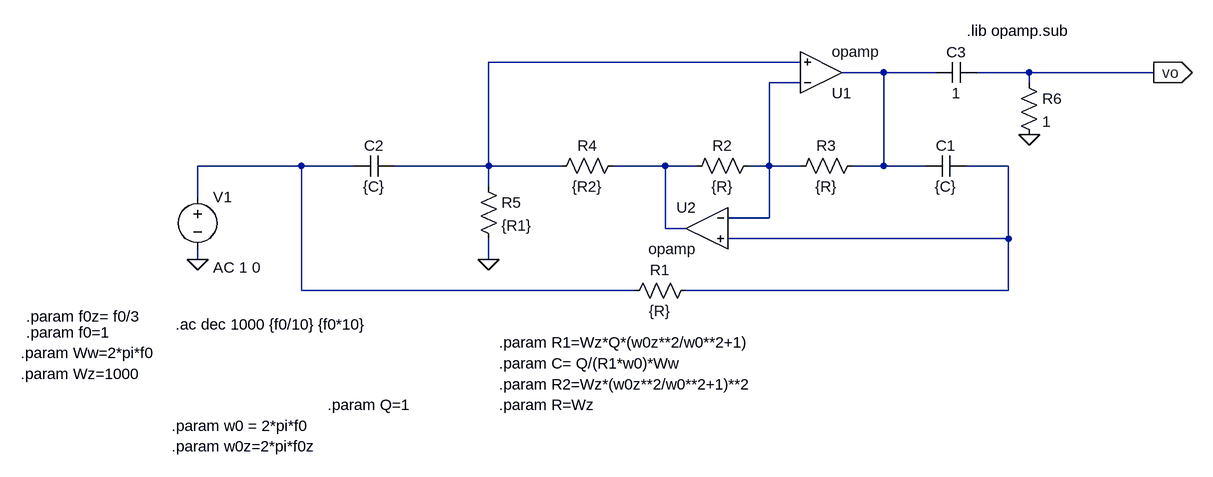
[diagram p0: schematic Ts5.asc]
Ts5.asc, the LTspice schematic file:
Version 4
SHEET 1 1100 680
WIRE 448 -64 -32 -64
WIRE 576 -48 512 -48
WIRE 656 -48 576 -48
WIRE 800 -48 720 -48
WIRE 992 -48 800 -48
WIRE 448 -32 400 -32
WIRE 800 -32 800 -48
WIRE -320 96 -480 96
WIRE -240 96 -320 96
WIRE -32 96 -32 -64
WIRE -32 96 -176 96
WIRE 80 96 -32 96
WIRE 240 96 160 96
WIRE 288 96 240 96
WIRE 400 96 400 -32
WIRE 400 96 368 96
WIRE 448 96 400 96
WIRE 576 96 576 -48
WIRE 576 96 528 96
WIRE 640 96 576 96
WIRE 768 96 704 96
WIRE -32 128 -32 96
WIRE -480 144 -480 96
WIRE 400 176 400 96
WIRE 400 176 336 176
WIRE 240 192 240 96
WIRE 272 192 240 192
WIRE 768 208 768 96
WIRE 768 208 336 208
WIRE -480 240 -480 224
WIRE -32 240 -32 208
WIRE -320 288 -320 96
WIRE 192 288 -320 288
WIRE 768 288 768 208
WIRE 768 288 272 288
FLAG -32 240 0
FLAG -480 240 0
FLAG 992 -48 vo
IOPIN 992 -48 Out
FLAG 800 48 0
SYMBOL res 288 272 R90
WINDOW 0 0 56 VBottom 2
WINDOW 3 32 56 VTop 2
SYMATTR InstName R1
SYMATTR Value {R}
SYMBOL res 384 80 R90
WINDOW 0 0 56 VBottom 2
WINDOW 3 32 56 VTop 2
SYMATTR InstName R2
SYMATTR Value {R}
SYMBOL res 544 80 R90
WINDOW 0 0 56 VBottom 2
WINDOW 3 32 56 VTop 2
SYMATTR InstName R3
SYMATTR Value {R}
SYMBOL res 176 80 R90
WINDOW 0 0 56 VBottom 2
WINDOW 3 32 56 VTop 2
SYMATTR InstName R4
SYMATTR Value {R2}
SYMBOL cap 704 80 R90
WINDOW 0 0 32 VBottom 2
WINDOW 3 32 32 VTop 2
SYMATTR InstName C1
SYMATTR Value {C}
SYMBOL cap -176 80 R90
WINDOW 0 0 32 VBottom 2
WINDOW 3 32 32 VTop 2
SYMATTR InstName C2
SYMATTR Value {C}
SYMBOL res -48 112 R0
SYMATTR InstName R5
SYMATTR Value {R1}
SYMBOL voltage -480 128 R0
WINDOW 123 24 124 Left 2
WINDOW 39 0 0 Left 2
SYMATTR InstName V1
SYMATTR Value ""
SYMATTR Value2 AC 1 0
SYMBOL Opamps\\opamp 480 16 M180
SYMATTR InstName U1
SYMBOL Opamps\\opamp 304 128 M0
SYMATTR InstName U2
SYMBOL cap 720 -64 R90
WINDOW 0 0 32 VBottom 2
WINDOW 3 32 32 VTop 2
SYMATTR InstName C3
SYMATTR Value 1
SYMBOL res 784 -48 R0
SYMATTR InstName R6
SYMATTR Value 1
TEXT 704 -112 Left 2 !.lib opamp.sub
TEXT -514 340 Left 2 !.ac dec 1000 {f0/10} {f0*10}
TEXT -16 400 Left 2 !.param C= Q/(R1*w0)*Ww
TEXT -752 384 Left 2 !.param Ww=2*pi*f0
TEXT -16 368 Left 2 !.param R1=Wz*Q*(w0z**2/w0**2+1)
TEXT -16 464 Left 2 !.param R=Wz
TEXT -752 416 Left 2 !.param Wz=1000
TEXT -16 432 Left 2 !.param R2=Wz*(w0z**2/w0**2+1)**2
TEXT -280 464 Left 2 !.param Q=1
TEXT -520 496 Left 2 !.param w0 = 2*pi*f0
TEXT -520 528 Left 2 !.param w0z=2*pi*f0z
TEXT -744 352 Left 2 !.param f0=1
TEXT -744 328 Left 2 !.param f0z= f0/3

The netlist it stands for:
* Ts5.asc
R1 N006 N004 {R}
R2 N003 N005 {R}
R3 N002 N003 {R}
R4 N005 N001 {R2}
C1 N006 N002 {C}
C2 N001 N004 {C}
R5 N001 0 {R1}
V1 N004 0 AC 1 0
XU1 N003 N001 N002 opamp Aol=100K GBW=10Meg  ; pins invin noninvin out
XU2 N003 N006 N005 opamp Aol=100K GBW=10Meg  ; pins invin noninvin out
C3 vo N002 1
R6 vo 0 1
.lib opamp.sub
.ac dec 1000 {f0/10} {f0*10}
.param C= Q/(R1*w0)*Ww
.param Ww=2*pi*f0
.param R1=Wz*Q*(w0z**2/w0**2+1)
.param R=Wz
.param Wz=1000
.param R2=Wz*(w0z**2/w0**2+1)**2
.param Q=1
.param w0 = 2*pi*f0
.param w0z=2*pi*f0z
.param f0=1
.param f0z= f0/3
.backanno
.end